# EAGLE design 16 smd (EAGLE 9.3.0)
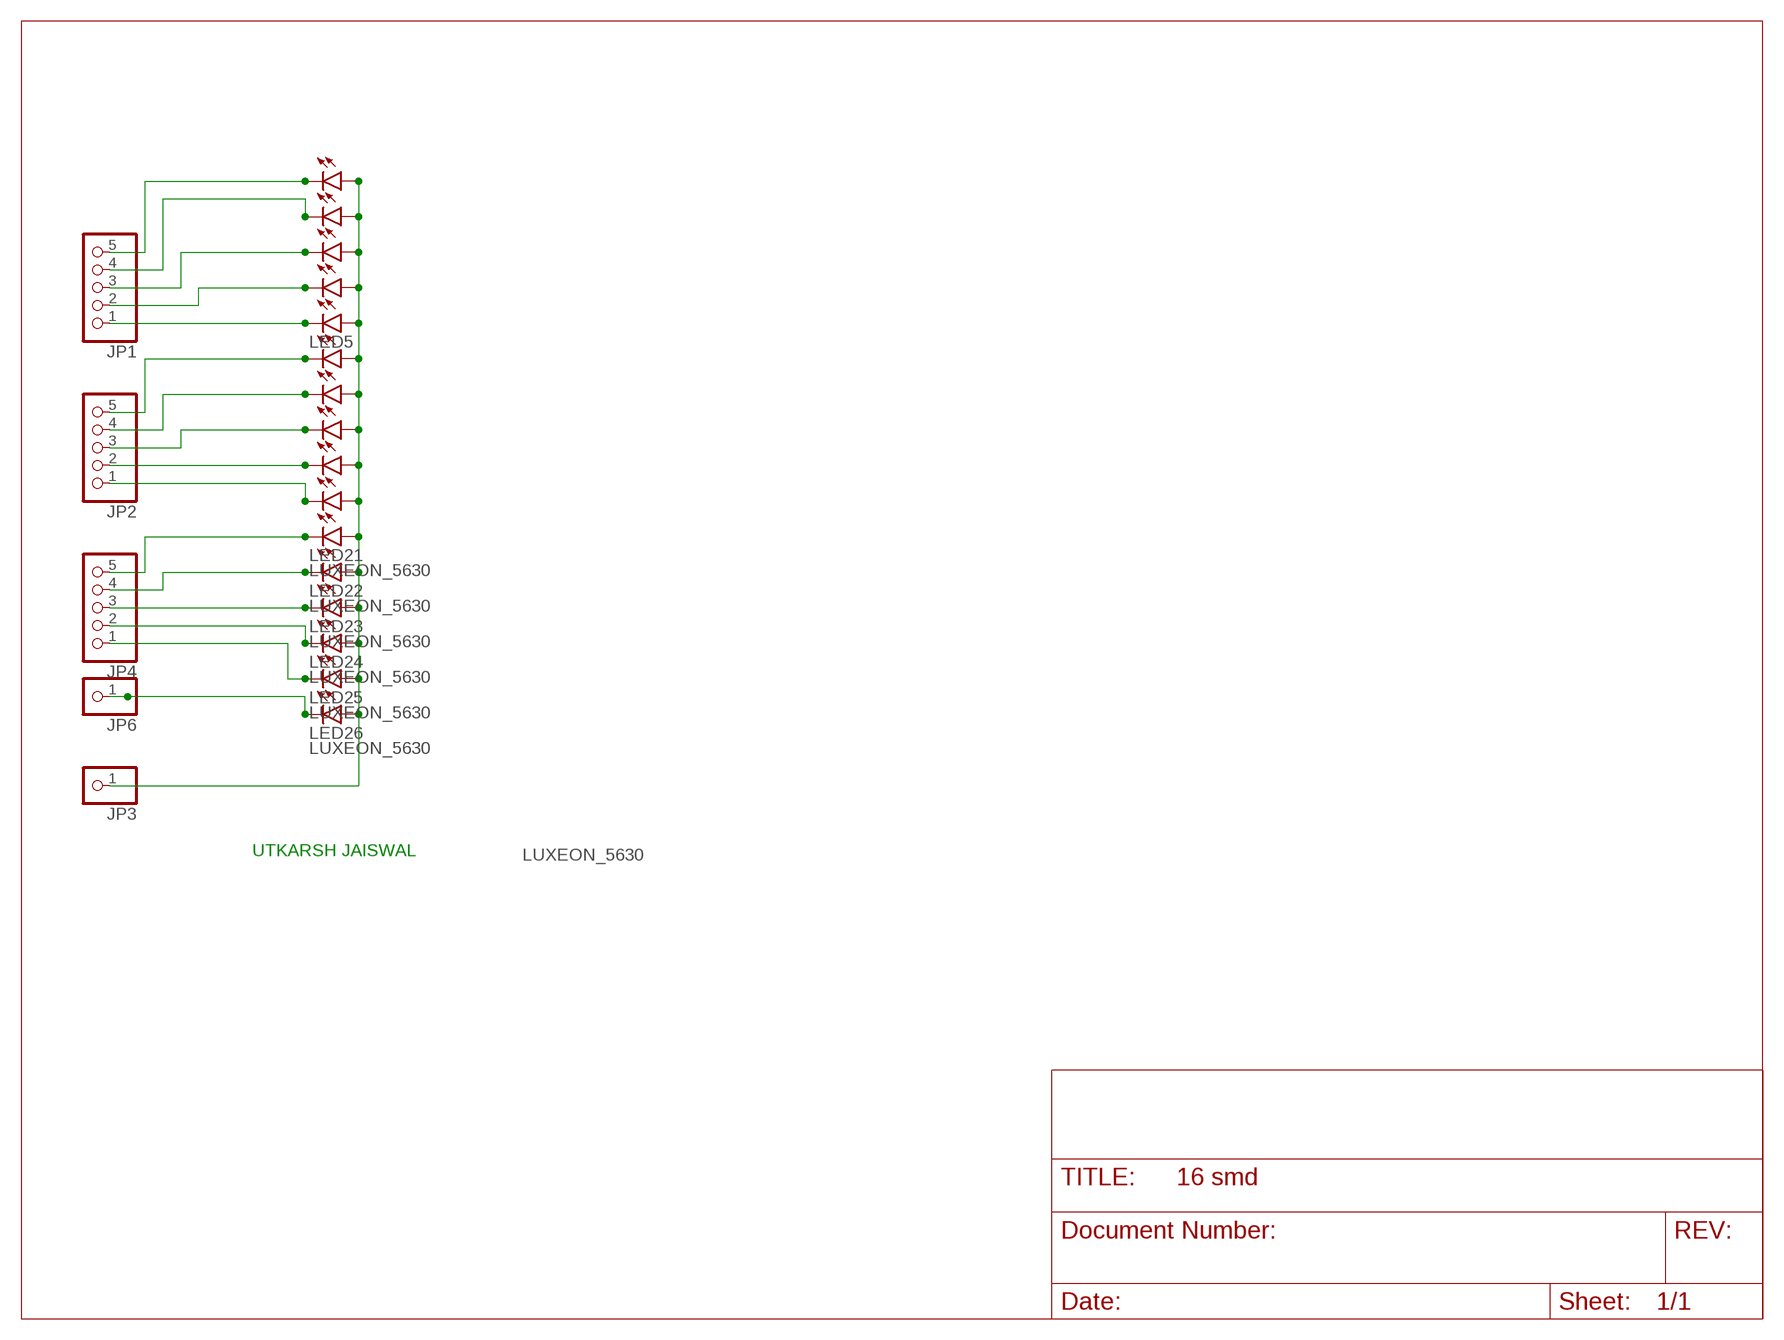
[diagram p0: schematic, sheet 1]

## Parts
JP1  PINHD-1X5  [1X05]
JP2  PINHD-1X5  [1X05]
JP3  PINHD-1X1  [1X01]
JP4  PINHD-1X5  [1X05]
JP6  PINHD-1X1  [1X01]
LED1  LUXEON_5630  [LUXEON_5630]
LED2  LUXEON_5630  [LUXEON_5630]
LED3  LUXEON_5630  [LUXEON_5630]
LED4  LUXEON_5630  [LUXEON_5630]
LED5  LUXEON_5630  [LUXEON_5630]
LED6  LUXEON_5630  [LUXEON_5630]
LED7  LUXEON_5630  [LUXEON_5630]
LED8  LUXEON_5630  [LUXEON_5630]
LED9  LUXEON_5630  [LUXEON_5630]
LED10  LUXEON_5630  [LUXEON_5630]
LED21  LUXEON_5630  [LUXEON_5630]
LED22  LUXEON_5630  [LUXEON_5630]
LED23  LUXEON_5630  [LUXEON_5630]
LED24  LUXEON_5630  [LUXEON_5630]
LED25  LUXEON_5630  [LUXEON_5630]
LED26  LUXEON_5630  [LUXEON_5630]

## Nets
N$1: JP1.5 LED1.1@1(C) LED1.1@2(C)
N$2: JP1.4 LED2.1@1(C) LED2.1@2(C)
N$3: JP1.3 LED3.1@1(C) LED3.1@2(C)
N$4: JP1.2 LED4.1@1(C) LED4.1@2(C)
N$5: JP1.1 LED5.1@1(C) LED5.1@2(C)
N$6: JP2.5 LED6.1@1(C) LED6.1@2(C)
N$7: JP2.4 LED7.1@1(C) LED7.1@2(C)
N$8: JP2.3 LED8.1@1(C) LED8.1@2(C)
N$9: JP2.2 LED9.1@1(C) LED9.1@2(C)
N$10: JP2.1 LED10.1@1(C) LED10.1@2(C)
N$11: JP4.5 LED21.1@1(C) LED21.1@2(C)
N$12: JP4.4 LED22.1@1(C) LED22.1@2(C)
N$13: JP4.3 LED23.1@1(C) LED23.1@2(C)
N$14: JP4.2 LED24.1@1(C) LED24.1@2(C)
N$15: JP4.1 LED25.1@1(C) LED25.1@2(C)
N$16: JP6.1 LED26.1@1(C) LED26.1@2(C)
N$18: JP3.1 LED1.2(A) LED2.2(A) LED3.2(A) LED4.2(A) LED5.2(A) LED6.2(A) LED7.2(A) LED8.2(A) LED9.2(A) LED10.2(A) LED21.2(A) LED22.2(A) LED23.2(A) LED24.2(A) LED25.2(A) LED26.2(A)

## Notes on the sheet
- UTKARSH JAISWAL

## Library data of the parts
JP1 JP2 JP4 = pinhead:PINHD-1X5: PIN HEADER
JP3 JP6 = pinhead:PINHD-1X1: PIN HEADER
LED1-LED10 LED21-LED26 = led:LUXEON_5630: LUXEON 5630 Mid-Power LEDs SD201 Source: Data sheet <www.philipslumileds.com/uploads/351/DS201-pdf> Lumileds 5630 Datasheet DS201 20130228 ©2013 Philips Lumileds Lighting Company.

## Board
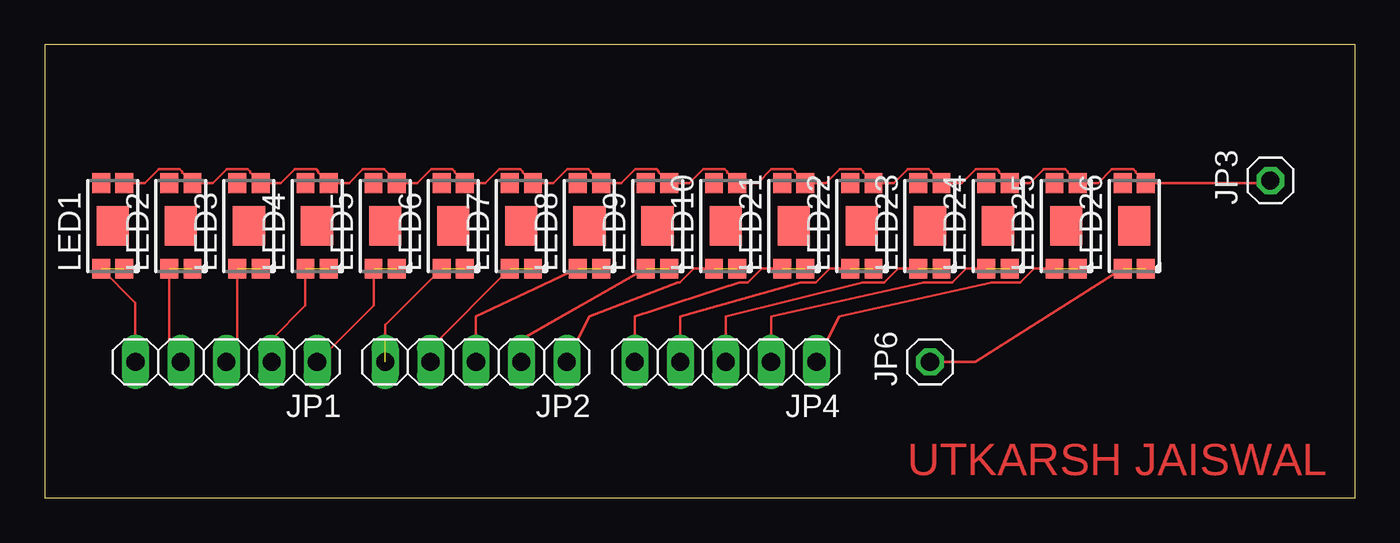
[diagram p1: board, top side]

Size 73.33 x 25.39 mm. Coordinates in mm from the lower left corner, seen from the top.
Outline: 0,0 73.33,0 73.33,25.39 0,25.39 0,0
Copper layers (1*16): Top 0.035mm / dielectric 1.5mm / Bottom 0.035mm
Design rules "default": minimum track width 6mil, minimum drill 0.35mm, track to track 6mil, track to pad 6mil, pad to pad 6mil, via to via 6mil, smd to smd 6mil, copper to edge 40mil, drill to drill 6mil, minimum pad ring 10mil, minimum via ring 8mil, stop-mask expansion 4mil, vias tented up to drill 0mil, thermal gap 10mil

### Footprints (pad centres in the part's own frame; a part is rotated, then mirrored left to right if it is on the bottom)
1X05 = drill 1.016 long: 1 -5.08,0; 2 -2.54,0; 3 0,0; 4 2.54,0; 5 5.08,0
1X01 = drill 1.016 octagon: 1 0,0
LUXEON_5630 = smd 1.1 x 1: 1@1 -2.4,-0.65; 1@2 -2.4,0.65; 2 2.4,-0.65; 4 2.4,0.65 | smd 2.2 x 1.8: 3 0,0

### Placement (x,y rotation side)
JP1  10.16,7.62 180 top
JP2  24.13,7.62 180 top
JP3  68.58,17.78 90 top
JP4  38.1,7.62 180 top
JP6  49.53,7.62 90 top
LED1  3.81,15.24 90 top
LED2  7.62,15.24 90 top
LED3  11.43,15.24 90 top
LED4  15.24,15.24 90 top
LED5  19.05,15.24 90 top
LED6  22.86,15.24 90 top
LED7  26.67,15.24 90 top
LED8  30.48,15.24 90 top
LED9  34.29,15.24 90 top
LED10  38.1,15.24 90 top
LED21  41.91,15.24 90 top
LED22  45.72,15.24 90 top
LED23  49.53,15.24 90 top
LED24  53.34,15.24 90 top
LED25  57.15,15.24 90 top
LED26  60.96,15.24 90 top

### Tracks (layer width: path | path; a pad name or v marks a point on that pad's centre or on a via)
N$1  (1 unrouted)
  Top 0.152: LED1.1@2 5.08,10.92 JP1.5
N$2  (1 unrouted)
  Top 0.152: JP1.4 6.97,8.27 LED2.1@2
N$3  (1 unrouted)
  Top 0.152: LED3.1@2 10.78,8.24 JP1.3
N$4  (1 unrouted)
  Top 0.152: LED4.1@2 14.59,10.78 12.7,8.89 JP1.2
N$5  (1 unrouted)
  Top 0.152: JP1.1 18.4,10.78 LED5.1@2
N$6  (2 unrouted)
  Top 0.152: LED6.1@2 19.05,9.68 19.05,8.89
N$7  (1 unrouted)
  Top 0.152: LED7.1@2 21.59,8.41 JP2.4
N$8  (1 unrouted)
  Top 0.152: LED8.1@2 24.13,10.16 JP2.3
N$9  (1 unrouted)
  Top 0.152: LED9.1@2 26.67,8.89 JP2.2
N$10  (1 unrouted)
  Top 0.152: LED10.1@2 36.31,12.84 35.53,12.06 35.42,12.06 30.48,10.16 JP2.1
N$11  (1 unrouted)
  Top 0.152: LED21.1@2 40.12,12.84 39.34,12.06 38.87,12.06 33.02,10.16 JP4.5
N$12  (1 unrouted)
  Top 0.152: LED22.1@2 43.93,12.84 43.16,12.06 42.31,12.06 35.56,10.16 JP4.4
N$13  (1 unrouted)
  Top 0.152: LED23.1@2 47.74,12.84 46.97,12.06 45.77,12.06 45.77,12.07 38.1,10.16 JP4.3
N$14  (1 unrouted)
  Top 0.152: LED24.1@2 51.55,12.84 50.77,12.06 49.19,12.06 40.64,10.16 JP4.2
N$15  (1 unrouted)
  Top 0.152: LED25.1@2 55.36,12.84 54.59,12.06 53,12.06 44.45,10.16 JP4.1
N$16  (1 unrouted)
  Top 0.152: LED26.1@2 52.07,7.62 JP6.1
N$18
  Top 0.152: JP3.1 68.44,17.64 LED26.2 61.04,18.21 61.04,18.28 60.91,18.42 59.72,18.42 58.94,17.64 LED25.2 57.23,18.21 57.23,18.28 57.09,18.42 55.91,18.42 55.13,17.64 LED24.2 53.42,18.21 53.42,18.28 53.28,18.42 52.09,18.42 51.32,17.64 LED23.2 49.61,18.21 49.61,18.28 49.48,18.42 48.28,18.42 47.51,17.64 LED22.2 45.8,18.21 45.8,18.28 45.66,18.42 44.48,18.42 43.7,17.64 LED21.2 41.99,18.21 41.99,18.28 41.85,18.42 40.66,18.42 39.89,17.64 LED10.2 38.18,18.21 38.18,18.28 38.05,18.42 36.85,18.42 36.08,17.64 LED9.2 34.37,18.21 34.37,18.28 34.23,18.42 33.05,18.42 32.27,17.64 LED8.2 30.56,18.21 30.56,18.28 30.43,18.42 29.23,18.42 28.46,17.64 LED7.2 26.75,18.21 26.75,18.28 26.61,18.42 25.43,18.42 24.65,17.64 LED6.2 22.94,18.21 22.94,18.28 22.8,18.42 21.61,18.42 20.84,17.64 LED5.2 20.32,17.78 19.63,17.78 19,18.42 17.8,18.42 17.03,17.64 LED4.2 15.32,18.21 15.32,18.28 15.19,18.42 13.99,18.42 13.22,17.64 LED3.2 11.51,18.21 11.51,18.28 11.38,18.42 10.19,18.42 9.41,17.64 LED2.2 7.7,18.21 7.7,18.28 7.57,18.42 6.38,18.42 5.6,17.64 LED1.2

### Text on the board
Top: UTKARSH JAISWAL